# Altium project OSD3358_MB.PrjPcb
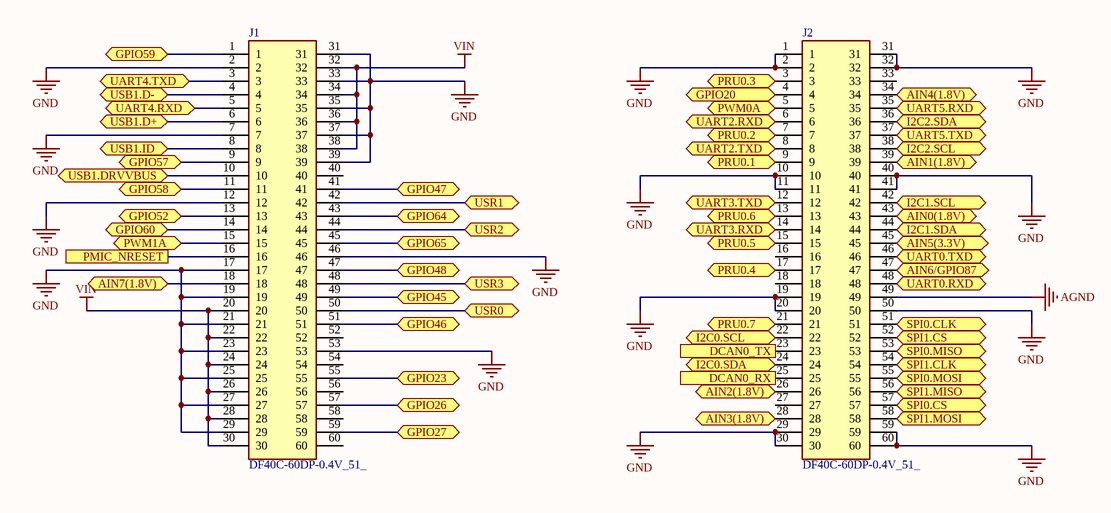
[diagram p0: Connecters.SchDoc]
1 sheet, 2 parts. Net scope: flat (ports and power ports of the same name join across sheets).
Board file: AviaNix.PcbDoc

## Sheet Connecters.SchDoc
size A4; SheetNumber: 2; SheetTotal: 2

### Parts
J1  DF40C-60DP-0.4V_51_  [DF40C-60DP-0.4V(51)]
J2  DF40C-60DP-0.4V_51_  [DF40C-60DP-0.4V(51)]

### Ports
AIN0(1.8V) (bidir), AIN1(1.8V) (bidir), AIN2(1.8V) (bidir), AIN3(1.8V) (bidir), AIN4(1.8V) (bidir), AIN5(3.3V) (bidir), AIN6/GPIO87 (bidir), AIN7(1.8V) (bidir), DCAN0_RX, DCAN0_TX, GPIO20 (bidir), GPIO23 (bidir), GPIO26 (bidir), GPIO27 (bidir), GPIO45 (bidir), GPIO46 (bidir), GPIO47 (bidir), GPIO48 (bidir), GPIO52 (bidir), GPIO57 (bidir), GPIO58 (bidir), GPIO59 (bidir), GPIO60 (bidir), GPIO64 (bidir), GPIO65 (bidir), I2C0.SCL (bidir), I2C0.SDA (bidir), I2C1.SCL (bidir), I2C1.SDA (bidir), I2C2.SCL (bidir), I2C2.SDA (bidir), PMIC_NRESET, PRU0.1 (bidir), PRU0.2 (bidir), PRU0.3 (bidir), PRU0.4 (bidir), PRU0.5 (bidir), PRU0.6 (bidir), PRU0.7 (bidir), PWM0A (bidir), PWM1A (bidir), SPI0.CLK (bidir), SPI0.CS (bidir), SPI0.MISO (bidir), SPI0.MOSI (bidir), SPI1.CLK (bidir), SPI1.CS (bidir), SPI1.MISO (bidir), SPI1.MOSI (bidir), UART0.RXD (bidir), UART0.TXD (bidir), UART2.RXD (bidir), UART2.TXD (bidir), UART3.RXD (bidir), UART3.TXD (bidir), UART4.RXD (bidir), UART4.TXD (bidir), UART5.RXD (bidir), UART5.TXD (bidir), USB1.D+ (bidir), USB1.D- (bidir), USB1.DRVVBUS (bidir), USB1.ID (bidir), USR0 (bidir), USR1 (bidir), USR2 (bidir), USR3 (bidir)

### Nets
AGND: J2.49
GND: J1.2 J1.7 J1.12 J1.17 J1.19 J1.21 J1.23 J1.25 J1.27 J1.29 J1.31 J1.33 J1.35 J1.37 J1.39 J1.46 J1.53 J2.1 J2.2 J2.10 J2.11 J2.19 J2.20 J2.29 J2.30 J2.31 J2.32 J2.40 J2.41 J2.50 J2.59 J2.60
VIN: J1.20 J1.22 J1.24 J1.26 J1.28 J1.30 J1.32 J1.34 J1.36 J1.38
NetJ1_1: J1.1 ; port GPIO59
NetJ1_3: J1.3 ; port UART4.TXD
NetJ1_4: J1.4 ; port USB1.D-
NetJ1_5: J1.5 ; port UART4.RXD
NetJ1_6: J1.6 ; port USB1.D+
NetJ1_8: J1.8 ; port USB1.ID
NetJ1_9: J1.9 ; port GPIO57
NetJ1_10: J1.10 ; port USB1.DRVVBUS
NetJ1_11: J1.11 ; port GPIO58
NetJ1_13: J1.13 ; port GPIO52
NetJ1_14: J1.14 ; port GPIO60
NetJ1_15: J1.15 ; port PWM1A
NetJ1_16: J1.16 ; port PMIC_NRESET
NetJ1_18: J1.18 ; port AIN7(1.8V)
NetJ1_41: J1.41 ; port GPIO47
NetJ1_42: J1.42 ; port USR1
NetJ1_43: J1.43 ; port GPIO64
NetJ1_44: J1.44 ; port USR2
NetJ1_45: J1.45 ; port GPIO65
NetJ1_47: J1.47 ; port GPIO48
NetJ1_48: J1.48 ; port USR3
NetJ1_49: J1.49 ; port GPIO45
NetJ1_50: J1.50 ; port USR0
NetJ1_51: J1.51 ; port GPIO46
NetJ1_55: J1.55 ; port GPIO23
NetJ1_57: J1.57 ; port GPIO26
NetJ1_59: J1.59 ; port GPIO27
NetJ2_3: J2.3 ; port PRU0.3
NetJ2_4: J2.4 ; port GPIO20
NetJ2_5: J2.5 ; port PWM0A
NetJ2_6: J2.6 ; port UART2.RXD
NetJ2_7: J2.7 ; port PRU0.2
NetJ2_8: J2.8 ; port UART2.TXD
NetJ2_9: J2.9 ; port PRU0.1
NetJ2_12: J2.12 ; port UART3.TXD
NetJ2_13: J2.13 ; port PRU0.6
NetJ2_14: J2.14 ; port UART3.RXD
NetJ2_15: J2.15 ; port PRU0.5
NetJ2_17: J2.17 ; port PRU0.4
NetJ2_21: J2.21 ; port PRU0.7
NetJ2_22: J2.22 ; port I2C0.SCL
NetJ2_23: J2.23 ; port DCAN0_TX
NetJ2_24: J2.24 ; port I2C0.SDA
NetJ2_25: J2.25 ; port DCAN0_RX
NetJ2_26: J2.26 ; port AIN2(1.8V)
NetJ2_28: J2.28 ; port AIN3(1.8V)
NetJ2_34: J2.34 ; port AIN4(1.8V)
NetJ2_35: J2.35 ; port UART5.RXD
NetJ2_36: J2.36 ; port I2C2.SDA
NetJ2_37: J2.37 ; port UART5.TXD
NetJ2_38: J2.38 ; port I2C2.SCL
NetJ2_39: J2.39 ; port AIN1(1.8V)
NetJ2_42: J2.42 ; port I2C1.SCL
NetJ2_43: J2.43 ; port AIN0(1.8V)
NetJ2_44: J2.44 ; port I2C1.SDA
NetJ2_45: J2.45 ; port AIN5(3.3V)
NetJ2_46: J2.46 ; port UART0.TXD
NetJ2_47: J2.47 ; port AIN6/GPIO87
NetJ2_48: J2.48 ; port UART0.RXD
NetJ2_51: J2.51 ; port SPI0.CLK
NetJ2_52: J2.52 ; port SPI1.CS
NetJ2_53: J2.53 ; port SPI0.MISO
NetJ2_54: J2.54 ; port SPI1.CLK
NetJ2_55: J2.55 ; port SPI0.MOSI
NetJ2_56: J2.56 ; port SPI1.MISO
NetJ2_57: J2.57 ; port SPI0.CS
NetJ2_58: J2.58 ; port SPI1.MOSI

Not connected (* = marked no-connect by the designer): J1 40 52 54 56 58 60; J2 16 18 27 33

### Library data of the parts
J1 J2 = DF40C-60DP-0.4V_51_: Connector; Manufacturer_Name: Hirose; System: Connecter; Datasheet Link: https://datasheet.datasheetarchive.com/originals/distributors/Datasheets-DGA17/1059795.pdf; Manufacturer_Part_Number: DF40C-60DP-0.4V(51); Mouser Part Number: 798-DF40C60DP0.4V51; Mouser Price/Stock: https://www.mouser.co.uk/ProductDetail/Hirose-Connector/DF40C-60DP-0.4V51?qs=eDUdFcBPps0%252B%252BrqDQtiLyw%3D%3D; Arrow Part Number: DF40C-60DP-0.4V(51); Arrow Price/Stock: https://www.arrow.com/en/products/df40c-60dp-0.4v-51/hirose-electric?region=nac